# EAGLE schematic MESP_0_2 (EAGLE 8.0.0)
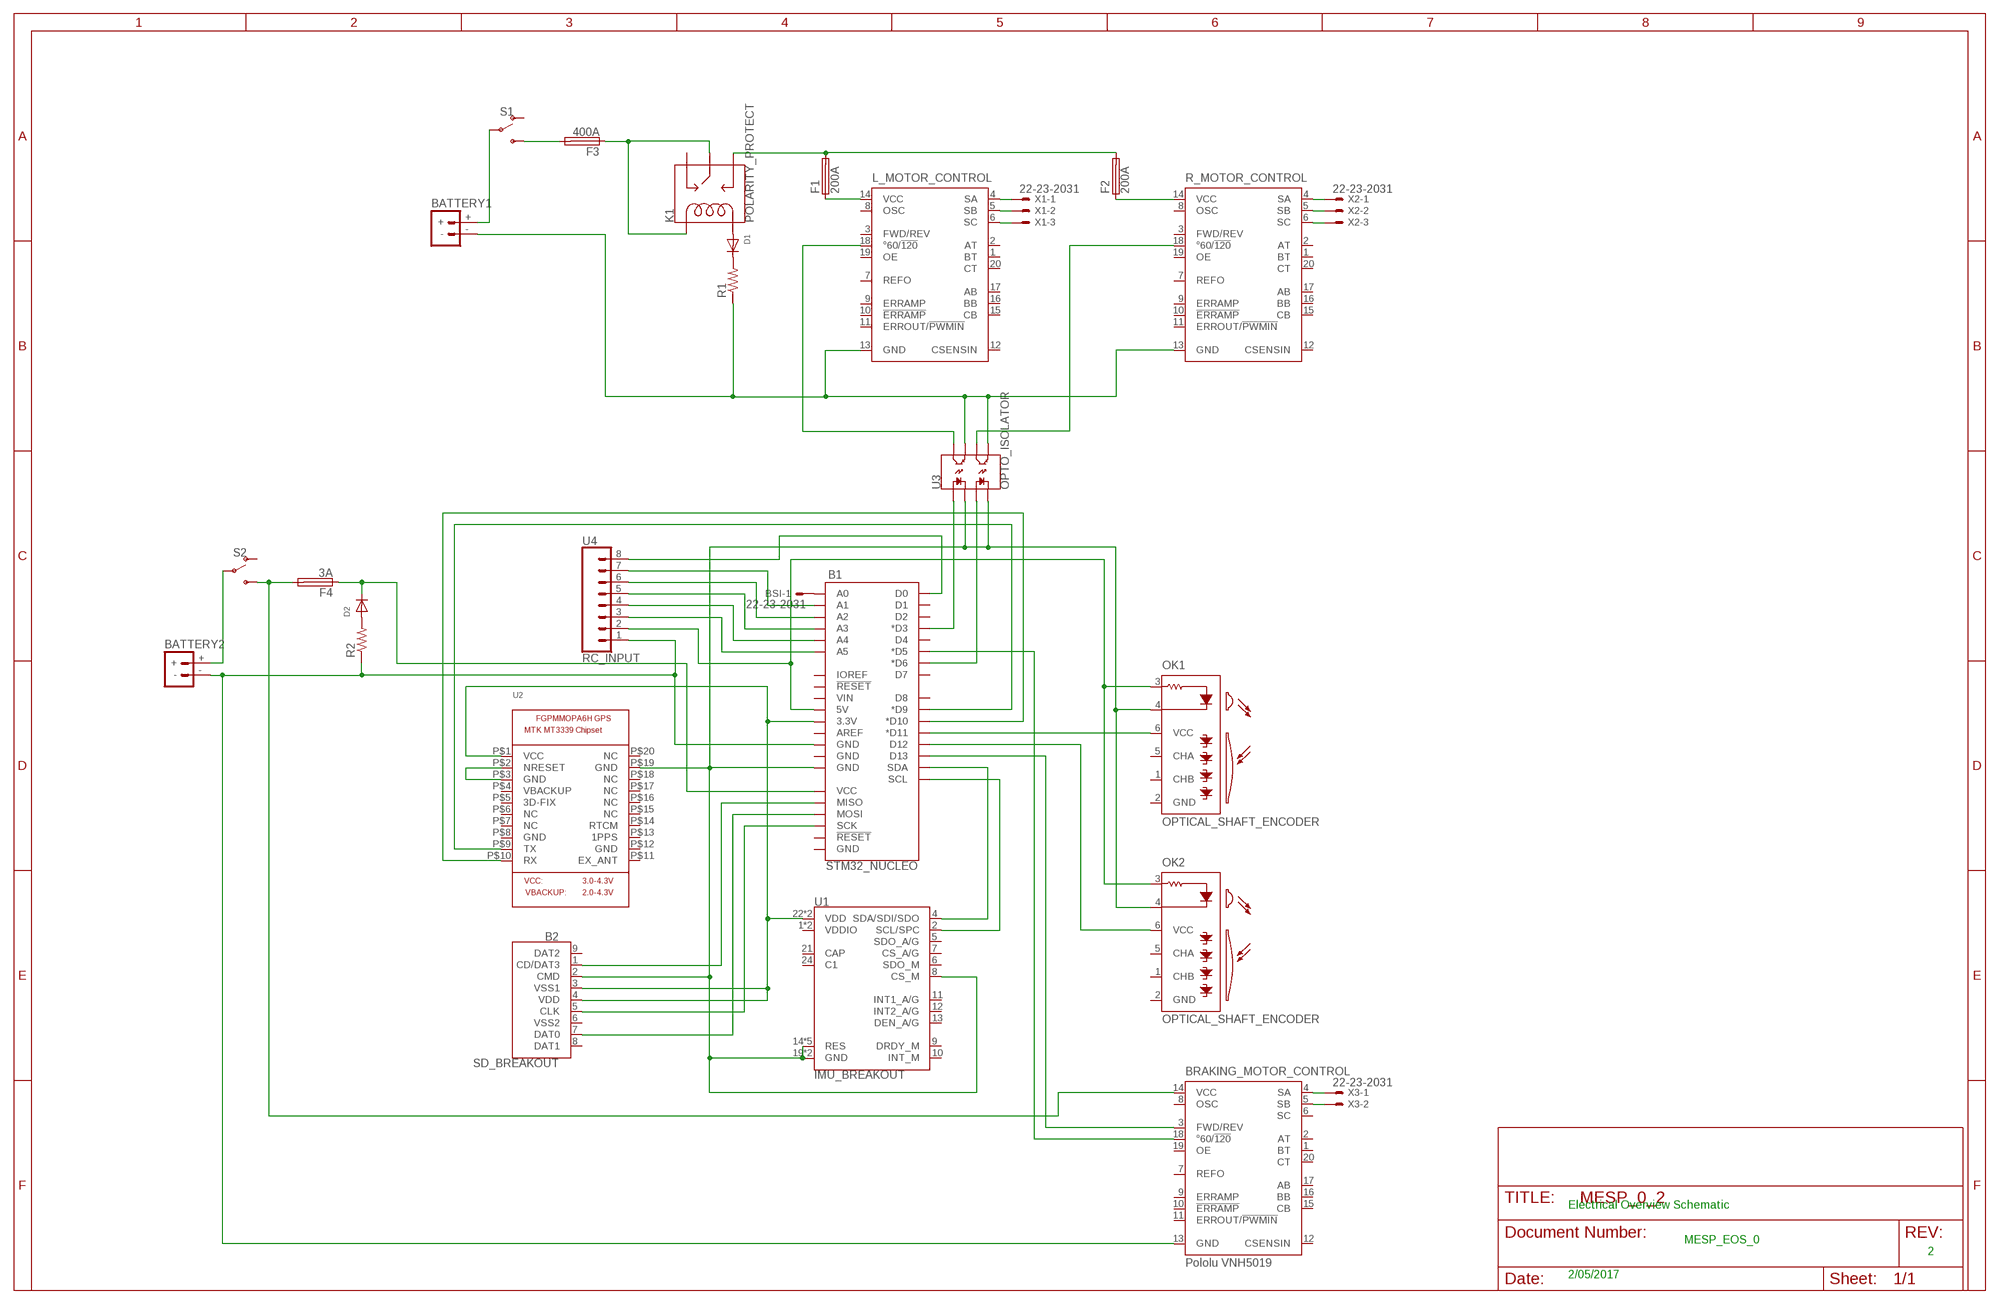
[diagram p0: schematic, sheet 1]

## Parts
B1  STM32_NUCLEO  ARDUINO_UNO_R3  [ARDUINO_R3]
B2  SD_BREAKOUT  SD_MMC_CARDSD_PCB  [SD-MMC-CARD]
BATTERY1  BATTERY_CONN_DEANS  [DEANS]
BATTERY2  BATTERY_CONN_DEANS  [DEANS]
BRAKING_MOTOR_CONTROL  Pololu VNH5019  MC33033DW  [SO20L]
BSI  22-23-2031  [22-23-2031]
D1  ADAFRUIT_DIODEDO-1N4148  [ADAFRUIT_DO-1N4148]
D2  ADAFRUIT_DIODEDO-1N4148  [ADAFRUIT_DO-1N4148]
F1  200A  TE5  [TE5]
F2  200A  TE5  [TE5]
F3  400A  19559  [19559]
F4  3A  19559  [19559]
K1  POLARITY_PROTECT  RELAY-SPDT-JZC-11F  [RELAY-JZC]
L_MOTOR_CONTROL  MC33033DW  [SO20L]
OK1  OPTICAL_SHAFT_ENCODER  AEDR-8300-K/P/Q  [AEDR-8300]
OK2  OPTICAL_SHAFT_ENCODER  AEDR-8300-K/P/Q  [AEDR-8300]
R1  R-US_0204/2V  [0204V]
R2  R-US_0204/2V  [0204V]
R_MOTOR_CONTROL  MC33033DW  [SO20L]
S1  SWITCH-SPDT-PTH-11.6X4.0MM  [SWITCH_SPDT_PTH_11.6X4.0MM]
S2  SWITCH-SPDT-PTH-11.6X4.0MM  [SWITCH_SPDT_PTH_11.6X4.0MM]
U1  IMU_BREAKOUT  LSM9DS1  [LGA-24-3.5X3]
U2  MICROBUILDER_GPS_FGPMMOPA6H  [MICROBUILDER_FGPMMOPA6H]
U3  OPTO_ISOLATOR  DUAL-OPTOISOLATOR_SOIC8  [SO08]
U4  RC_INPUT  CONN_08LONGPADS  [1X08_LONGPADS]
X1  22-23-2031  [22-23-2031]
X2  22-23-2031  [22-23-2031]
X3  22-23-2031  [22-23-2031]

## Nets
N$1: B1.D11(*D11) OK1.6(VCC)
N$2: B1.3.3V B2.3(VSS1) B2.4(VDD) U1.22(VDD) U1.23(VDD) U2.P$1(VCC)
N$3: BRAKING_MOTOR_CONTROL.4(SA) X3.1
N$4: B1.SDA U1.4(SDA/SDI/SDO)
N$5: B1.SCL U1.2(SCL/SPC)
N$6: B1.D10(*D10) U2.P$10(RX)
N$7: U2.P$2(NRESET) U2.P$3(GND)
N$8: B1.GND@2(GND) B2.2(CMD) OK1.4(C) OK2.4(C) U1.8(CS_M) U1.14(RES) U1.15(RES) U1.16(RES) U1.17(RES) U1.18(RES) U1.19(GND) U1.20(GND) U2.P$19(GND) U3.2(C1) U3.4(C2)
N$9: L_MOTOR_CONTROL.4(SA) X1.1
N$10: B1.D12 OK2.6(VCC)
N$11: F1.1 L_MOTOR_CONTROL.14(VCC)
N$12: BATTERY1.- L_MOTOR_CONTROL.13(GND) R1.1 R_MOTOR_CONTROL.13(GND) U3.5(EM2) U3.7(EM1)
N$13: BRAKING_MOTOR_CONTROL.5(SB) X3.2
N$14: F1.2 F2.2 K1.3(NO)
N$15: B1.D13 BRAKING_MOTOR_CONTROL.3(FWD/REV)
N$16: D1.A K1.1(COIL2)
N$17: D1.C R1.2
N$18: F3.2 S1.3(S)
N$19: BATTERY1.+ S1.2(P)
N$20: L_MOTOR_CONTROL.18(°60/!120) U3.8(CL1)
N$21: R_MOTOR_CONTROL.18(°60/!120) U3.6(CL2)
N$22: B1.D6(*D6) U3.3(A2)
N$23: B1.D3(*D3) U3.1(A1)
N$24: B1.MOSI B2.7(DAT0)
N$25: B1.SCK B2.5(CLK)
N$26: B1.MISO B2.1(CD/DAT3)
N$27: B1.D0 U4.8
N$28: D2.A R2.2
N$29: B1.GND@4(GND) BATTERY2.- BRAKING_MOTOR_CONTROL.13(GND) R2.1 U4.1
N$30: B1.VCC D2.C F4.1
N$31: B1.D5(*D5) BRAKING_MOTOR_CONTROL.18(°60/!120)
N$32: BRAKING_MOTOR_CONTROL.14(VCC) F4.2 S2.3(S)
N$33: BATTERY2.+ S2.2(P)
N$34: B1.A2 U4.6
N$35: B1.A3 U4.5
N$36: B1.A4 U4.4
N$37: B1.A5 U4.3
N$38: B1.5V OK1.3(A) OK2.3(A) U4.2
N$39: L_MOTOR_CONTROL.5(SB) X1.2
N$40: L_MOTOR_CONTROL.6(SC) X1.3
N$41: R_MOTOR_CONTROL.4(SA) X2.1
N$42: R_MOTOR_CONTROL.5(SB) X2.2
N$43: R_MOTOR_CONTROL.6(SC) X2.3
R1: F3.1 K1.4(MAIN) K1.5(COIL1)
R_MOTOR_CONTROL: F2.1 R_MOTOR_CONTROL.14(VCC)
SFGFD: B1.A1 U4.7
U3: B1.D9(*D9) U2.P$9(TX)
Unconnected: B1.A0 B1.AREF B1.D1 B1.D2 B1.D4 B1.D7 B1.D8 B1.GND@1(GND) B1.GND@3(GND) B1.IOREF B1.RESET@1(!RESET!) B1.RESET@2(!RESET!) B1.VIN B2.6(VSS2) B2.8(DAT1) B2.9(DAT2) BRAKING_MOTOR_CONTROL.1(BT) BRAKING_MOTOR_CONTROL.2(AT) BRAKING_MOTOR_CONTROL.6(SC) BRAKING_MOTOR_CONTROL.7(REFO) BRAKING_MOTOR_CONTROL.8(OSC) BRAKING_MOTOR_CONTROL.9(ERRAMP) BRAKING_MOTOR_CONTROL.10(!ERRAMP) BRAKING_MOTOR_CONTROL.11(ERROUT/!PWMIN) BRAKING_MOTOR_CONTROL.12(CSENSIN) BRAKING_MOTOR_CONTROL.15(CB) BRAKING_MOTOR_CONTROL.16(BB) BRAKING_MOTOR_CONTROL.17(AB) BRAKING_MOTOR_CONTROL.19(OE) BRAKING_MOTOR_CONTROL.20(CT) BSI.1 BSI.2 BSI.3 K1.2(NC) L_MOTOR_CONTROL.1(BT) L_MOTOR_CONTROL.2(AT) L_MOTOR_CONTROL.3(FWD/REV) L_MOTOR_CONTROL.7(REFO) L_MOTOR_CONTROL.8(OSC) L_MOTOR_CONTROL.9(ERRAMP) L_MOTOR_CONTROL.10(!ERRAMP) L_MOTOR_CONTROL.11(ERROUT/!PWMIN) L_MOTOR_CONTROL.12(CSENSIN) L_MOTOR_CONTROL.15(CB) L_MOTOR_CONTROL.16(BB) L_MOTOR_CONTROL.17(AB) L_MOTOR_CONTROL.19(OE) L_MOTOR_CONTROL.20(CT) OK1.1(CHB) OK1.2(GND) OK1.5(CHA) OK2.1(CHB) OK2.2(GND) OK2.5(CHA) R_MOTOR_CONTROL.1(BT) R_MOTOR_CONTROL.2(AT) R_MOTOR_CONTROL.3(FWD/REV) R_MOTOR_CONTROL.7(REFO) R_MOTOR_CONTROL.8(OSC) R_MOTOR_CONTROL.9(ERRAMP) R_MOTOR_CONTROL.10(!ERRAMP) R_MOTOR_CONTROL.11(ERROUT/!PWMIN) R_MOTOR_CONTROL.12(CSENSIN) R_MOTOR_CONTROL.15(CB) R_MOTOR_CONTROL.16(BB) R_MOTOR_CONTROL.17(AB) R_MOTOR_CONTROL.19(OE) R_MOTOR_CONTROL.20(CT) S1.1(O) S2.1(O) U1.1(VDDIO) U1.3(VDDIO) U1.5(SDO_A/G) U1.6(SDO_M) U1.7(CS_A/G) U1.9(DRDY_M) U1.10(INT_M) U1.11(INT1_A/G) U1.12(INT2_A/G) U1.13(DEN_A/G) U1.21(CAP) U1.24(C1) U2.P$4(VBACKUP) U2.P$5(3D-FIX) U2.P$6(NC) U2.P$7(NC) U2.P$8(GND) U2.P$11(EX_ANT) U2.P$12(GND) U2.P$13(1PPS) U2.P$14(RTCM) U2.P$15(NC) U2.P$16(NC) U2.P$17(NC) U2.P$18(NC) U2.P$20(NC) X3.3

## Notes on the sheet
- Electrical Overview Schematic
- MESP_EOS_0
- 2
- 2/05/2017

## Power pins joined to a net without a drawn wire
GND: OK1.E1(GND) OK1.E2(GND) OK2.E1(GND) OK2.E2(GND)

## Library data of the parts
B1 = SparkFun-Boards:ARDUINO_UNO_R3: Arduino R3 Footprint with SPI header Arduino Uno R3 Compatible Footprint. Matches PCB size of the original board. SparkFun Products: SAMD21 Dev Breakout <https://www.sparkfun.com/products/13672> RedBoard <https://www.sparkfun.com/products/12757> R3 Stackable Headers <https://www.sparkfun.com/products/11417>
B2 = SparkFun-Boards:SD_MMC_CARD: SD MMC Card Footprint Mechanical footprint with connectors of an SD/MMC card- NOT a socket! SparkFun Products: Electric Imp <https://www.sparkfun.com/products/11395> microSD Card with SD adapter <https://www.sparkfun.com/products/13833>
BATTERY1 BATTERY2 = SparkFun-Connectors:BATTERY_CONN: Battery Connectors Various footprints for battery connections SparkFun Products: Deans Connector -M/F Pair <https://www.sparkfun.com/products/11864>; SF_ID: PRT-11864
BRAKING_MOTOR_CONTROL L_MOTOR_CONTROL R_MOTOR_CONTROL = motorola-sensor-driver:*33033: Brushless DC Motor Controller http://onsemi.com; mc33033-d.pdf; MF: ON SEMICONDUCTOR; MPN: MC33033DW; OC_FARNELL: 1364058; OC_NEWARK: 07F4692
BSI X1-X3 = con-molex:22-23-2031: .100" (2.54mm) Center Header - 3 Pin; MF: MOLEX; MPN: 22-23-2031; OC_FARNELL: 1462950; OC_NEWARK: 30C0862
D1 D2 = Adafruit Ultimate GPS:ADAFRUIT_DIODE: Diode SMADIODE - SMA Surface Mount Package 20V 1A Schottky Diode Digikey: 641-1014-6-ND DO-1N4148 - Through Hole Small Current Diode SOD-123 20V 1 A (.5mV Vf) Schottky Diode - Digikey: MBRX120TPMSCT-ND SOD-323 10V 570mA (.38mV Vf, 3ns) Schottky Diode - Digikey: ZLLS410CT-ND SOD-523 30V 30mA Schottky Diode (RB751S-40TE61) - Digikey: RB751S-40TE61CT-ND SOT23-R/W - SOT23 Package (R = Solder Paste/Reflow Ovens, W = Hand-Soldering) BAT54Film 40V 300mA - Digikey: 497-7162-1-ND
F1 F2 = fuse:TE5: FUSE Wickmann; OC_FARNELL: unknown; OC_NEWARK: unknown
F3 F4 = fuse:19559: FUSE HOLDER TR5, Wickmann; MPN: 55900000001; OC_FARNELL: 9516360; OC_NEWARK: 02P0286
K1 = SparkFun-Electromechanical:RELAY-SPDT: SPDT Electromechanical Relay Single-pole, double-throw sealed relays. When current is applied to the coil, it throws a simple changeover switch, terminating the connection from the NC contact to ground and closing the NO contact. Use them to switch high voltage/high current devices. SparkFun Products JQX-15F: Relay SPDT Sealed - 20A <https://www.sparkfun.com/products/10924> (COM-10924) JZC-11F: Relay SPDT Sealed <https://www.sparkfun.com/products/100> (COM-00100); PROD_ID: COMP-09533; SF_SKU: COM-00100
OK1 OK2 = optocoupler:AEDR-8300-K: Agilent AEDR-8300 Series Encoders Reflective Surface Mount Optical Encoder Source: http: http://www.avagotech.com .. AV02-0088EN-1.pdf; MF: AGILENT TECHNOLOGIES; MPN: AEDR-8300-1P2; OC_FARNELL: 1161102; OC_NEWARK: 08J1020
R1 R2 = MESP_0_1:R-US_: RESISTOR, American symbol
S1 S2 = SparkFun-Switches:SWITCH-SPDT: Single Pole, Double Throw (SPDT) Switch Single-pole, double-throw (SPDT) switch. Variant Overview SMD-AYZ0202 Surface Mount DPDT Switch <https://www.sparkfun.com/products/597> (COM-00597) Used on e.g. LilyPad Arduino USB - ATmega32U4 Board <https://www.sparkfun.com/products/12049> PTH-11.6X4.0MM SPDT Mini Power Switch <https://www.sparkfun.com/products/102> (COM-00102) Used on e.g. SparkFun Simon Says - Through-Hole Soldering Kit <https://www.sparkfun.com/products/10547> (KIT-10547) PTH-11.6X4.0MM-KIT KIT version of SPDT Mini Power Switch - Simplifies soldering by removing tStop of switch pins - only one side can be soldered. PTH-11.6X4.0MM-LOCK LOCK version of SPDT Mini Power Switch - Offset pins hold switch in place for easier soldering. SMD-RIGHT-ANGLE Surface Mount Right Angle Switch <https://www.sparkfun.com/products/10860> (COM-10860) Used on e.g. SparkFun ESP8266 Thing <https://www.sparkfun.com/products/13231>; PROD_ID: SWCH-08261; SF_SKU: COM-00102
U1 = SparkFun-Sensors:LSM9DS1: ST Microelectronics LSM9DS1 9DOF IMU - Accelerometer, Gyroscope & Magnetometer The LSM9DS1 is a versatile, motion-sensing system-in-a-chip. It houses a 3-axis accelerometer, 3-axis gyroscope, and 3-axis magnetometer – nine degrees of freedom (9DOF) in a single IC! The LSM9DS1 is equipped with a digital interface, but even that is flexible: it supports both I2C and SPI, so you’ll be hard-pressed to find a microcontroller it doesn’t work with. Datasheet <https://cdn.sparkfun.com/assets/learn_tutorials/3/7/3/LSM9DS1_Datasheet.pdf> SparkFun Products SparkFun 9 Degrees of Freedom IMU Breakout - LSM9DS1 <https://www.sparkfun.com/products/13284> (SEN-13284) SparkFun Photon IMU Shield <https://www.sparkfun.com/products/13629> (DEV-13629); PROD_ID: IC-12536
U2 = Adafruit Ultimate GPS:MICROBUILDER_GPS_FGPMMOPA6H: GPS Module - MTK MT3339 Chipset, -165dBm sensitivity, 22 channels, 10Hz, auto-select external antenna options
U3 = SparkFun-DiscreteSemi:DUAL-OPTOISOLATOR: Optocoupler, Phototransistor Output, Dual Channel Optically coupled pairs with a gallium arsenide infrared LED and a silicon NPN phototransistor. Signal information, including a DC level, can be transmitted by the device while maintaining a high degree of electrical isolation between input and output. Datasheet <https://www.sparkfun.com/datasheets/Components/SMD/ild205t.pdf> SparkFun Products: SparkFun Opto-isolator Breakout <https://www.sparkfun.com/products/9118>; PROD_ID: IC-09076
U4 = SparkFun-Connectors:CONN_08: Multi connection point. Often used as Generic Header-pin footprint for 0.1 inch spaced/style header connections On any of the 0.1 inch spaced packages, you can populate with these: Break Away Headers - Straight <https://www.sparkfun.com/products/116> (PRT-00116) Break Away Male Headers - Right Angle <https://www.sparkfun.com/products/553> (PRT-00553) Female Headers <https://www.sparkfun.com/products/115> (PRT-00115) Break Away Headers - Machine Pin <https://www.sparkfun.com/products/117> (PRT-00117) Break Away Female Headers - Swiss Machine Pin <https://www.sparkfun.com/products/743> (PRT-00743) Arduino Stackable Header - 8 Pin <https://www.sparkfun.com/products/9279> (PRT-09279) For SCREWTERMINALS and SPRING TERMINALS visit here: Screw Terimnals on SparkFun.com <https://www.sparkfun.com/search/results?term=Screw+Terminals> (5mm/3.5mm/2.54mm spacing) This device is also useful as a general connection point to wire up your design to another part of your project. Our various solder wires solder well into these plated through hole pads. Hook-Up Wire - Assortment (Stranded, 22 AWG) <https://www.sparkfun.com/products/11375> (PRT-11375) Hook-Up Wire - Assortment (Solid Core, 22 AWG) <https://www.sparkfun.com/products/11367> (PRT-11367) View the entire wire category on our website here <https://www.sparkfun.com/categories/141> Special notes: Molex polarized connector foot print use with SKU : PRT-08231 with associated crimp pins and housings. 1MM SMD Version SKU: PRT-10208 NOTES ON THE VARIANTS LOCK and LOCK_LONGPADS... This footprint was designed to help hold the alignment of a through-hole component (i.e. 6-pin header) while soldering it into place. You may notice that each hole has been shifted either up or down by 0.005 of an inch from it's more standard position (which is a perfectly straight line). This slight alteration caused the pins (the squares in the middle) to touch the edges of the holes. Because they are alternating, it causes a "brace" to hold the component in place. 0.005 has proven to be the perfect amount of "off-center" position when using our standard breakaway headers. Although looks a little odd when you look at the bare footprint, once you have a header in there, the alteration is very hard to notice. Also,if you push a header all the way into place, it is covered up entirely on the bottom side.